# EAGLE schematic FU92G6PJT4TMZTU (EAGLE 9.2.2)
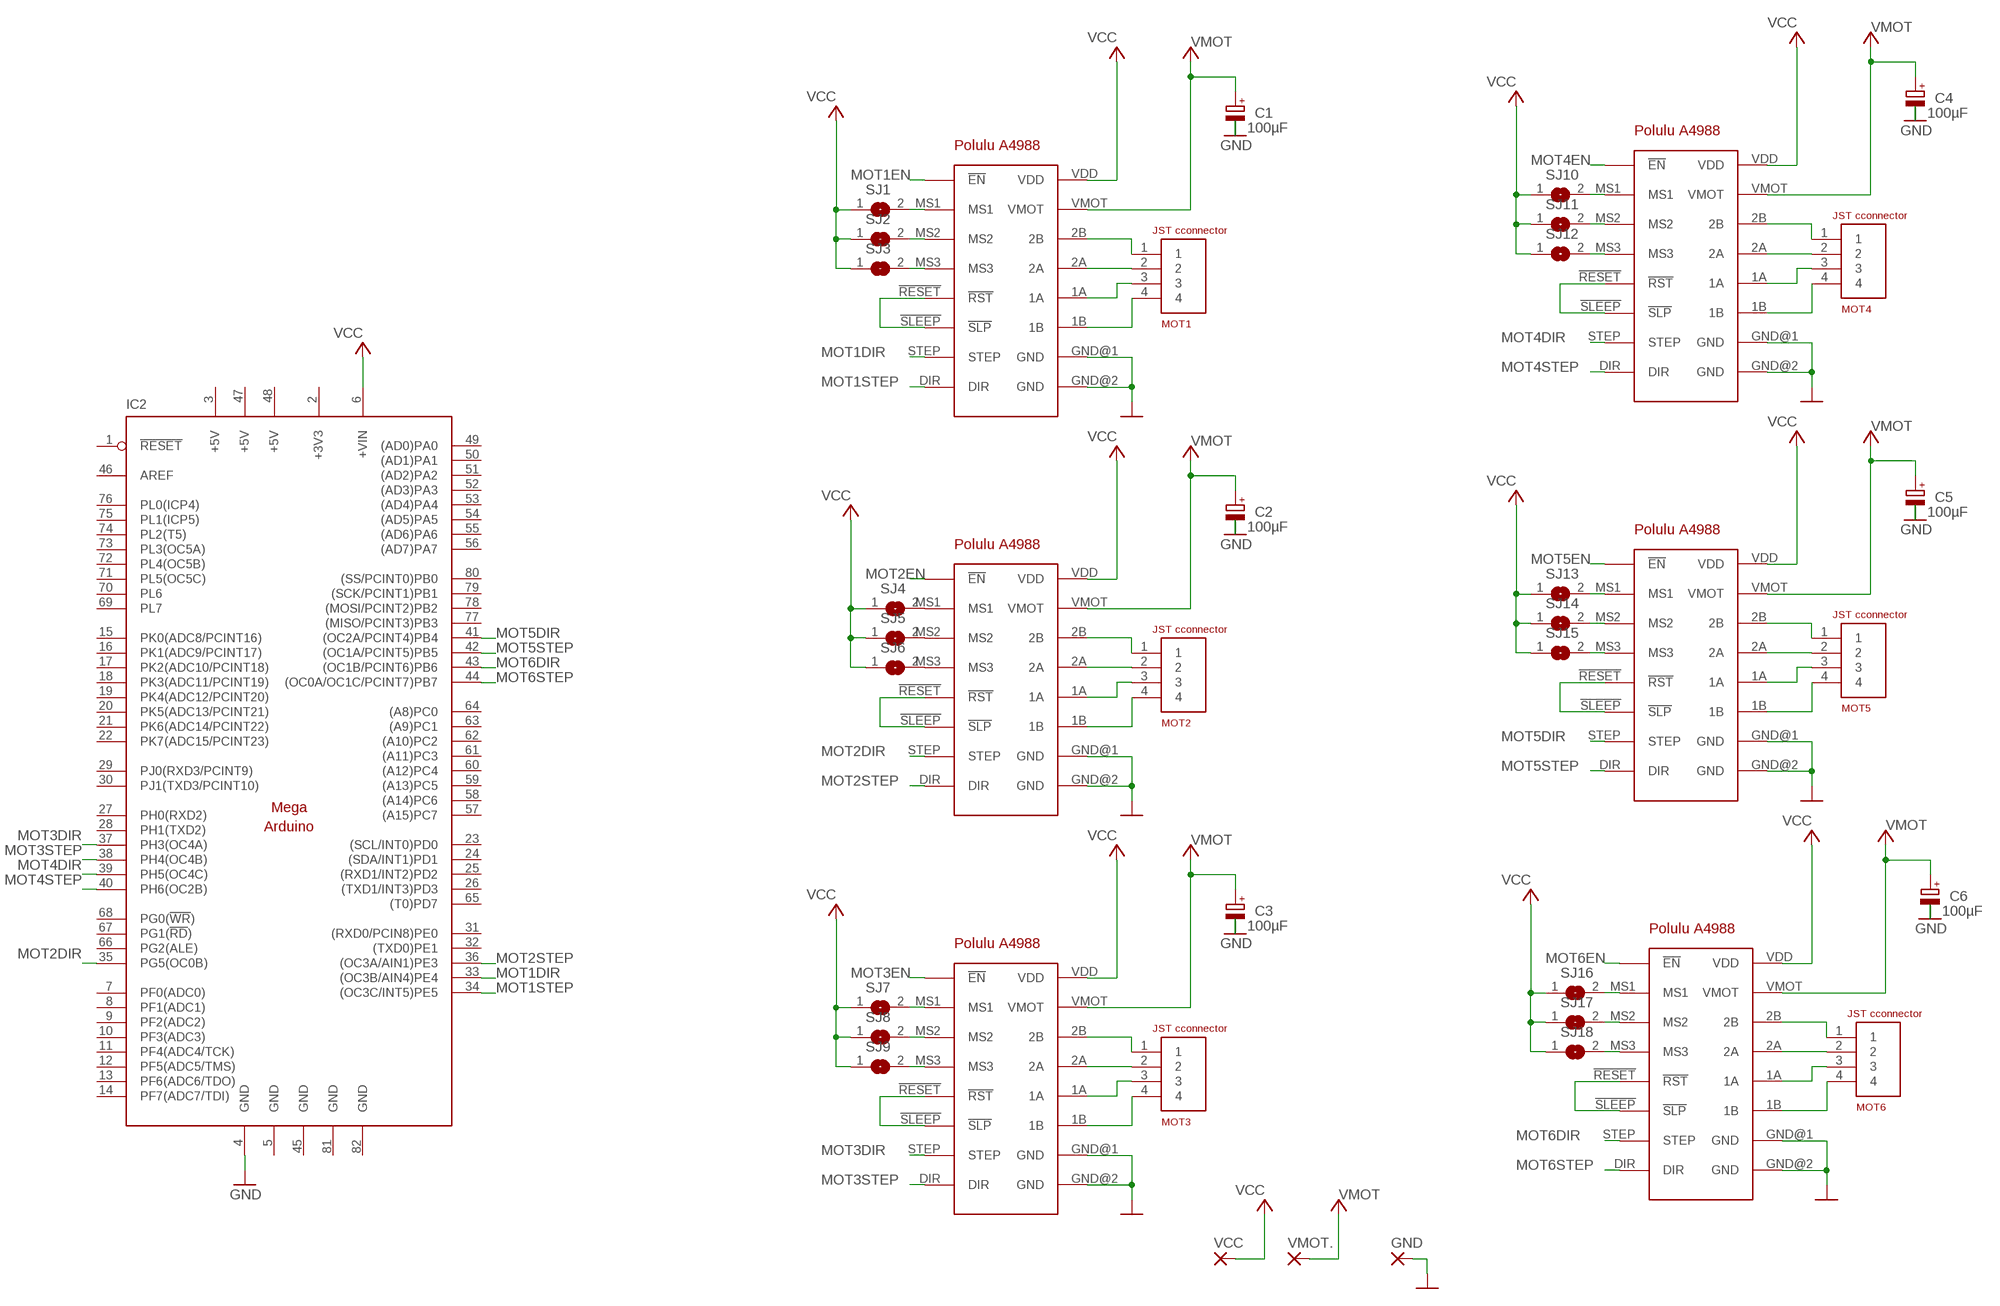
[diagram p0: schematic, sheet 1]

## Parts
C1  100µF  CPOL-EUTT2D7  [TT2D7]
C2  100µF  CPOL-EUTT2D7  [TT2D7]
C3  100µF  CPOL-EUTT2D7  [TT2D7]
C4  100µF  CPOL-EUTT2D7  [TT2D7]
C5  100µF  CPOL-EUTT2D7  [TT2D7]
C6  100µF  CPOL-EUTT2D7  [TT2D7]
GND  3,17/1,3  [3,17/1,3]
IC2  MEGAARDUINO_11  [MEGA_ARDUINO_1]
M1  POLULUA4988CORRECT  [POLULU_A4988]
M2  POLULUA4988CORRECT  [POLULU_A4988]
M3  POLULUA4988CORRECT  [POLULU_A4988]
M4  POLULUA4988CORRECT  [POLULU_A4988]
M5  POLULUA4988CORRECT  [POLULU_A4988]
M6  POLULUA4988CORRECT  [POLULU_A4988]
MOT1  4PIN_JST  [4PIN_JST]
MOT2  4PIN_JST  [4PIN_JST]
MOT3  4PIN_JST  [4PIN_JST]
MOT4  4PIN_JST  [4PIN_JST]
MOT5  4PIN_JST  [4PIN_JST]
MOT6  4PIN_JST  [4PIN_JST]
SJ1  SJW  [SJW]
SJ2  SJW  [SJW]
SJ3  SJW  [SJW]
SJ4  SJW  [SJW]
SJ5  SJW  [SJW]
SJ6  SJW  [SJW]
SJ7  SJW  [SJW]
SJ8  SJW  [SJW]
SJ9  SJW  [SJW]
SJ10  SJW  [SJW]
SJ11  SJW  [SJW]
SJ12  SJW  [SJW]
SJ13  SJW  [SJW]
SJ14  SJW  [SJW]
SJ15  SJW  [SJW]
SJ16  SJW  [SJW]
SJ17  SJW  [SJW]
SJ18  SJW  [SJW]
VCC  3,17/1,3  [3,17/1,3]
VMOT.  3,17/1,3  [3,17/1,3]

## Nets
GND: C1.- C2.- C3.- C4.- C5.- C6.- GND.1(P) IC2.4(GND) M1.GND@1(GND) M1.GND@2(GND) M2.GND@1(GND) M2.GND@2(GND) M3.GND@1(GND) M3.GND@2(GND) M4.GND@1(GND) M4.GND@2(GND) M5.GND@1(GND) M5.GND@2(GND) M6.GND@1(GND) M6.GND@2(GND)
MOT1DIR: IC2.33((OC3B/AIN4)PE4) M1.STEP
MOT1EN: M1.!EN
MOT1STEP: IC2.34((OC3C/INT5)PE5) M1.DIR
MOT2DIR: IC2.35(PG5(OC0B)) M2.STEP
MOT2EN: M2.!EN
MOT2STEP: IC2.36((OC3A/AIN1)PE3) M2.DIR
MOT3DIR: IC2.37(PH3(OC4A)) M3.STEP
MOT3EN: M3.!EN
MOT3STEP: IC2.38(PH4(OC4B)) M3.DIR
MOT4DIR: IC2.39(PH5(OC4C)) M4.STEP
MOT4EN: M4.!EN
MOT4STEP: IC2.40(PH6(OC2B)) M4.DIR
MOT5DIR: IC2.41((OC2A/PCINT4)PB4) M5.STEP
MOT5EN: M5.!EN
MOT5STEP: IC2.42((OC1A/PCINT5)PB5) M5.DIR
MOT6DIR: IC2.43((OC1B/PCINT6)PB6) M6.STEP
MOT6EN: M6.!EN
MOT6STEP: IC2.44((OC0A/OC1C/PCINT7)PB7) M6.DIR
N$2: M1.MS1 SJ1.2
N$3: M1.MS2 SJ2.2
N$4: M1.MS3 SJ3.2
N$5: M1.2B MOT1.1
N$6: M1.2A MOT1.2
N$7: M1.1A MOT1.3
N$8: M1.1B MOT1.4
N$10: M2.MS1 SJ4.2
N$11: M2.MS2 SJ5.2
N$12: M2.MS3 SJ6.2
N$13: M2.2B MOT2.1
N$14: M2.2A MOT2.2
N$15: M2.1A MOT2.3
N$16: M2.1B MOT2.4
N$17: M2.!RESET(!RST) M2.!SLEEP(!SLP)
N$19: M3.MS1
N$20: M3.MS2
N$21: M3.MS3
N$22: M3.2B MOT3.1
N$23: M3.2A MOT3.2
N$24: M3.1A MOT3.3
N$25: M3.1B MOT3.4
N$26: M3.!RESET(!RST) M3.!SLEEP(!SLP)
N$28: SJ7.2
N$29: SJ8.2
N$30: SJ9.2
N$31: M4.2B MOT4.1
N$32: M4.2A MOT4.2
N$33: M4.1A MOT4.3
N$34: M4.1B MOT4.4
N$35: M4.!RESET(!RST) M4.!SLEEP(!SLP)
N$37: M4.MS1 SJ10.2
N$38: M4.MS2 SJ11.2
N$39: M4.MS3 SJ12.2
N$40: M5.2B MOT5.1
N$41: M5.2A MOT5.2
N$42: M5.1A MOT5.3
N$43: M5.1B MOT5.4
N$44: M5.!RESET(!RST) M5.!SLEEP(!SLP)
N$46: M5.MS1 SJ13.2
N$47: M5.MS2 SJ14.2
N$48: M5.MS3 SJ15.2
N$49: M6.2B MOT6.1
N$50: M6.2A MOT6.2
N$51: M6.1A MOT6.3
N$52: M6.1B MOT6.4
N$53: M6.!RESET(!RST) M6.!SLEEP(!SLP)
N$54: M6.MS1 SJ16.2
N$55: M6.MS2 SJ17.2
N$56: M6.MS3 SJ18.2
N$58: M1.!RESET(!RST) M1.!SLEEP(!SLP)
VCC: IC2.6(+VIN) M1.VDD M2.VDD M3.VDD M4.VDD M5.VDD M6.VDD SJ1.1 SJ2.1 SJ3.1 SJ4.1 SJ5.1 SJ6.1 SJ7.1 SJ8.1 SJ9.1 SJ10.1 SJ11.1 SJ12.1 SJ13.1 SJ14.1 SJ15.1 SJ16.1 SJ17.1 SJ18.1 VCC.1(P)
VMOT: C1.+ C2.+ C3.+ C4.+ C5.+ C6.+ M1.VMOT M2.VMOT M3.VMOT M4.VMOT M5.VMOT M6.VMOT VMOT..1(P)
Unconnected: IC2.1(!RESET) IC2.7(PF0(ADC0)) IC2.8(PF1(ADC1)) IC2.9(PF2(ADC2)) IC2.10(PF3(ADC3)) IC2.11(PF4(ADC4/TCK)) IC2.12(PF5(ADC5/TMS)) IC2.13(PF6(ADC6/TDO)) IC2.14(PF7(ADC7/TDI)) IC2.15(PK0(ADC8/PCINT16)) IC2.16(PK1(ADC9/PCINT17)) IC2.17(PK2(ADC10/PCINT18)) IC2.18(PK3(ADC11/PCINT19)) IC2.19(PK4(ADC12/PCINT20)) IC2.20(PK5(ADC13/PCINT21)) IC2.21(PK6(ADC14/PCINT22)) IC2.22(PK7(ADC15/PCINT23)) IC2.23((SCL/INT0)PD0) IC2.24((SDA/INT1)PD1) IC2.25((RXD1/INT2)PD2) IC2.26((TXD1/INT3)PD3) IC2.27(PH0(RXD2)) IC2.28(PH1(TXD2)) IC2.29(PJ0(RXD3/PCINT9)) IC2.30(PJ1(TXD3/PCINT10)) IC2.31((RXD0/PCIN8)PE0) IC2.32((TXD0)PE1) IC2.46(AREF) IC2.49((AD0)PA0) IC2.50((AD1)PA1) IC2.51((AD2)PA2) IC2.52((AD3)PA3) IC2.53((AD4)PA4) IC2.54((AD5)PA5) IC2.55((AD6)PA6) IC2.56((AD7)PA7) IC2.57((A15)PC7) IC2.58((A14)PC6) IC2.59((A13)PC5) IC2.60((A12)PC4) IC2.61((A11)PC3) IC2.62((A10)PC2) IC2.63((A9)PC1) IC2.64((A8)PC0) IC2.65((T0)PD7) IC2.66(PG2(ALE)) IC2.67(PG1(!RD!)) IC2.68(PG0(!WR!)) IC2.69(PL7) IC2.70(PL6) IC2.71(PL5(OC5C)) IC2.72(PL4(OC5B)) IC2.73(PL3(OC5A)) IC2.74(PL2(T5)) IC2.75(PL1(ICP5)) IC2.76(PL0(ICP4)) IC2.77((MISO/PCINT3)PB3) IC2.78((MOSI/PCINT2)PB2) IC2.79((SCK/PCINT1)PB1) IC2.80((SS/PCINT0)PB0)

## Power pins joined to a net without a drawn wire
+3V3: IC2.2(+3V3)
+5V: IC2.3(+5V) IC2.47(+5V) IC2.48(+5V)
GND: IC2.5(GND) IC2.45(GND) IC2.81(GND) IC2.82(GND)

## Library data of the parts
C1-C6 = rcl:CPOL-EU: POLARIZED CAPACITOR, European symbol; SPICEPREFIX: C
GND VCC VMOT. = wirepad:3,17/1,3: THROUGH-HOLE PAD
IC2 = arduino:MEGAARDUINO_1: The Arduino Mega is a microcontroller board based on the ATmega1280. - 54 digital input/output pins (of which 14 can be used as PWM outputs) - 16 analog inputs - 4 UARTs (hardware serial ports) - 16 MHz crystal oscillator - USB connection - power jack - ICSP header - reset button It contains everything needed to support the microcontroller; simply connect it to a computer with a USB cable or power it with a AC-to-DC adapter or battery to get started. The Mega is compatible with most shields designed for the Arduino Duemilanove or Diecimila. http://arduino.cc/en/Main/ArduinoBoardMega
M1-M6 = Costume:POLULUA4988
MOT1-MOT6 = Costume:4PIN_JST
SJ1-SJ18 = jumper:SJ: SMD solder JUMPER